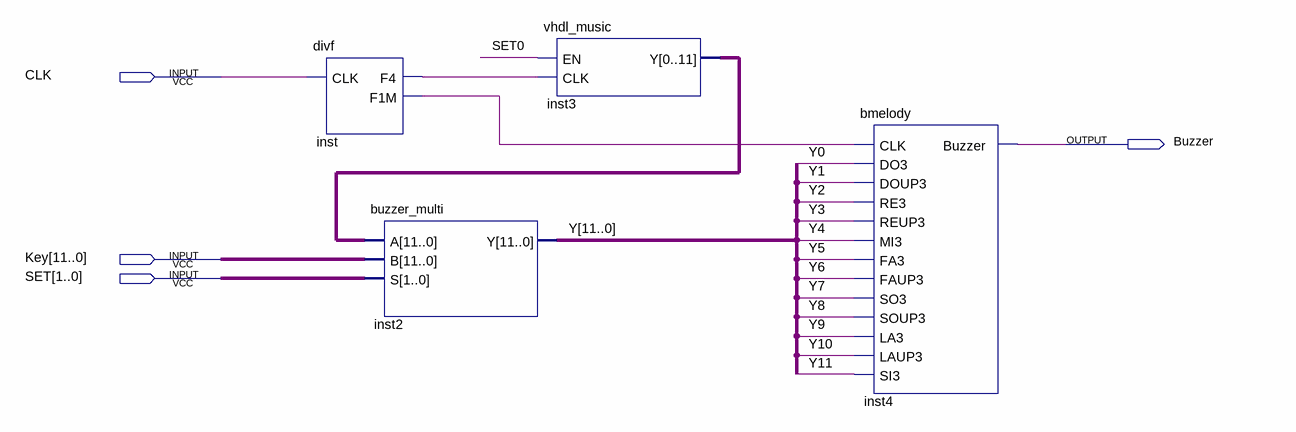
[diagram p0: schematic sheet]
// Quartus schematic buzzer_com.bdf as structural Verilog: 4 symbols, 4 pins
module buzzer_com (
  input  CLK,
  input  [11:0] Key,
  input  [1:0] SET,
  output Buzzer
);

  wire inst_f1m, inst_f4;
  wire [11:0] inst3_y, Y;

  divf inst (.CLK(CLK), .F4(inst_f4), .F1M(inst_f1m));
  buzzer_multi inst2 (.A(inst3_y), .B(Key), .S(SET), .Y(Y));
  vhdl_music inst3 (.EN(SET[0]), .CLK(inst_f4), .Y(inst3_y));
  bmelody inst4 (
    .CLK(inst_f1m), .DO3(Y[0]), .DOUP3(Y[1]), .RE3(Y[2]), .REUP3(Y[3]), .MI3(Y[4]), .FA3(Y[5]), .FAUP3(Y[6]),
    .SO3(Y[7]), .SOUP3(Y[8]), .LA3(Y[9]), .LAUP3(Y[10]), .SI3(Y[11]), .Buzzer(Buzzer));
endmodule
